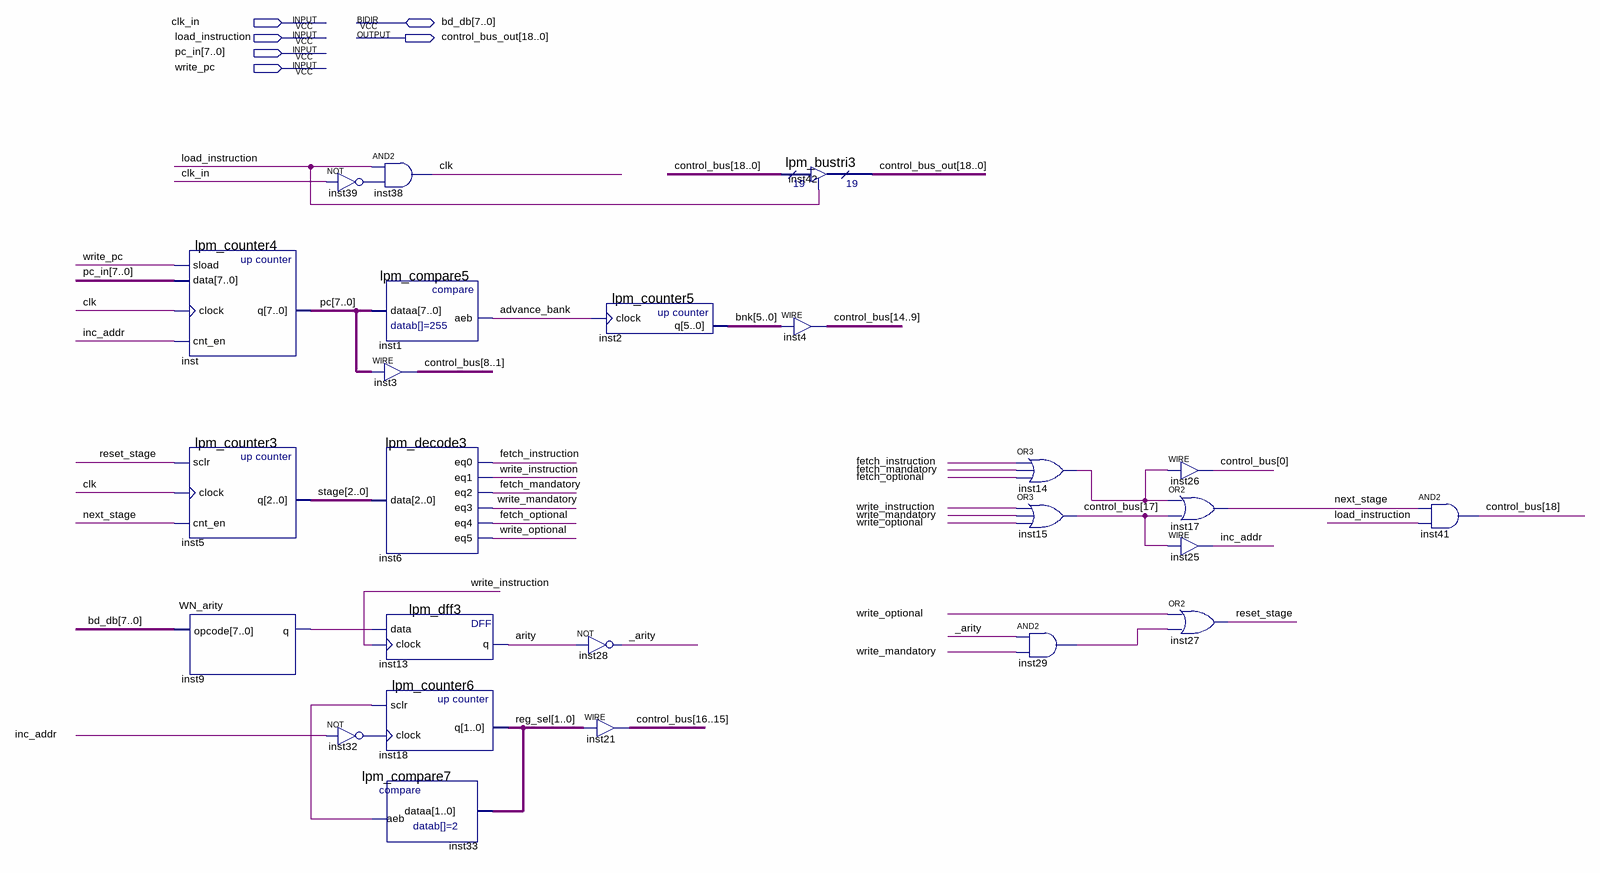
[diagram p0: schematic sheet]
// Quartus schematic WN_opcode_loader.bdf as structural Verilog: 25 symbols, 6 pins
module WN_opcode_loader (
  input  clk_in,
  input  load_instruction,
  input  [7:0] pc_in,
  input  write_pc,
  inout  [7:0] bd_db,
  output [18:0] control_bus_out
);

  wire _arity, advance_bank, arity, clk, fetch_instruction, fetch_mandatory, fetch_optional, inc_addr,
       inst9_q, inst14_out, inst29_out, inst32_out, inst33_aeb, inst39_out, next_stage, reset_stage,
       write_instruction, write_mandatory, write_optional;
  wire [1:0] reg_sel;
  wire [2:0] stage;
  wire [5:0] bnk;
  wire [7:0] pc;
  wire [18:0] control_bus;

  lpm_counter4 inst (.sload(write_pc), .data(pc_in), .clock(clk), .cnt_en(inc_addr), .q(pc));
  lpm_counter3 inst5 (.sclr(reset_stage), .clock(clk), .cnt_en(next_stage), .q(stage));
  WN_arity inst9 (.opcode(bd_db), .q(inst9_q));
  not inst39 (inst39_out, clk_in);
  not inst32 (inst32_out, inc_addr);
  and inst38 (clk, load_instruction, inst39_out);
  lpm_compare5 inst1 (.dataa(pc), .aeb(advance_bank));
  assign control_bus[8:1] = pc;  // WIRE inst3
  lpm_decode3 inst6 (
    .data(stage), .eq0(fetch_instruction), .eq1(write_instruction), .eq2(fetch_mandatory),
    .eq3(write_mandatory), .eq4(fetch_optional), .eq5(write_optional));
  lpm_dff3 inst13 (.data(inst9_q), .clock(write_instruction), .q(arity));
  lpm_counter6 inst18 (.sclr(inst33_aeb), .clock(inst32_out), .q(reg_sel));
  lpm_compare7 inst33 (.dataa(reg_sel), .aeb(inst33_aeb));
  not inst28 (_arity, arity);
  lpm_counter5 inst2 (.clock(advance_bank), .q(bnk));
  assign control_bus[16:15] = reg_sel;  // WIRE inst21
  lpm_bustri3 inst42 (.enabledt(load_instruction), .data(control_bus), .tridata(control_bus_out));
  assign control_bus[14:9] = bnk;  // WIRE inst4
  or inst14 (inst14_out, fetch_instruction, fetch_mandatory, fetch_optional);
  or inst15 (control_bus[17], write_instruction, write_mandatory, write_optional);
  and inst29 (inst29_out, _arity, write_mandatory);
  assign control_bus[0] = inst14_out;  // WIRE inst26
  or inst17 (next_stage, inst14_out, control_bus[17]);
  assign inc_addr = control_bus[17];  // WIRE inst25
  or inst27 (reset_stage, write_optional, inst29_out);
  and inst41 (control_bus[18], next_stage, load_instruction);
endmodule
